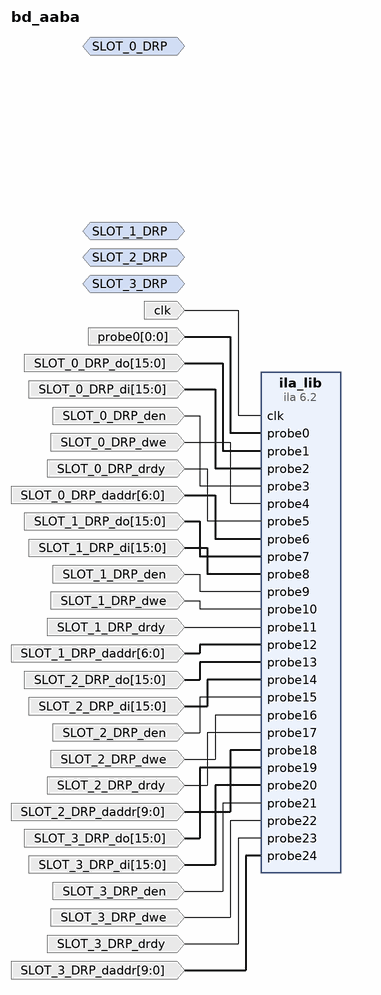
[diagram p0: block diagram of the top level]
# Vivado block design bd_aaba, xcku5p-ffvb676-2-e, Vivado 2018.1
create_bd_design bd_aaba

create_bd_intf_port -mode Monitor -vlnv xilinx.com:interface:drp_rtl:1.0 SLOT_0_DRP
create_bd_intf_port -mode Monitor -vlnv xilinx.com:interface:drp_rtl:1.0 SLOT_1_DRP
create_bd_intf_port -mode Monitor -vlnv xilinx.com:interface:drp_rtl:1.0 SLOT_2_DRP
create_bd_intf_port -mode Monitor -vlnv xilinx.com:interface:drp_rtl:1.0 SLOT_3_DRP
create_bd_port -dir I -type clk clk
create_bd_port -dir I -from 0 -to 0 probe0
create_bd_port -dir I -from 15 -to 0 SLOT_0_DRP_do
create_bd_port -dir I -from 15 -to 0 SLOT_0_DRP_di
create_bd_port -dir I SLOT_0_DRP_den
create_bd_port -dir I SLOT_0_DRP_dwe
create_bd_port -dir I SLOT_0_DRP_drdy
create_bd_port -dir I -from 6 -to 0 SLOT_0_DRP_daddr
create_bd_port -dir I -from 15 -to 0 SLOT_1_DRP_do
create_bd_port -dir I -from 15 -to 0 SLOT_1_DRP_di
create_bd_port -dir I SLOT_1_DRP_den
create_bd_port -dir I SLOT_1_DRP_dwe
create_bd_port -dir I SLOT_1_DRP_drdy
create_bd_port -dir I -from 6 -to 0 SLOT_1_DRP_daddr
create_bd_port -dir I -from 15 -to 0 SLOT_2_DRP_do
create_bd_port -dir I -from 15 -to 0 SLOT_2_DRP_di
create_bd_port -dir I SLOT_2_DRP_den
create_bd_port -dir I SLOT_2_DRP_dwe
create_bd_port -dir I SLOT_2_DRP_drdy
create_bd_port -dir I -from 9 -to 0 SLOT_2_DRP_daddr
create_bd_port -dir I -from 15 -to 0 SLOT_3_DRP_do
create_bd_port -dir I -from 15 -to 0 SLOT_3_DRP_di
create_bd_port -dir I SLOT_3_DRP_den
create_bd_port -dir I SLOT_3_DRP_dwe
create_bd_port -dir I SLOT_3_DRP_drdy
create_bd_port -dir I -from 9 -to 0 SLOT_3_DRP_daddr

create_bd_cell -type ip -vlnv xilinx.com:ip:ila:6.2 ila_lib
set_property -dict [list \
  CONFIG.C_PROBE24_TYPE 0 \
  CONFIG.C_PROBE23_TYPE 0 \
  CONFIG.C_PROBE22_TYPE 0 \
  CONFIG.C_PROBE21_TYPE 0 \
  CONFIG.C_PROBE20_TYPE 0 \
  CONFIG.C_PROBE19_TYPE 0 \
  CONFIG.C_PROBE18_TYPE 0 \
  CONFIG.C_PROBE17_TYPE 0 \
  CONFIG.C_PROBE16_TYPE 0 \
  CONFIG.C_PROBE15_TYPE 0 \
  CONFIG.C_PROBE14_TYPE 0 \
  CONFIG.C_PROBE13_TYPE 0 \
  CONFIG.C_PROBE12_TYPE 0 \
  CONFIG.C_PROBE11_TYPE 0 \
  CONFIG.C_PROBE10_TYPE 0 \
  CONFIG.C_PROBE9_TYPE 0 \
  CONFIG.C_PROBE8_TYPE 0 \
  CONFIG.C_PROBE7_TYPE 0 \
  CONFIG.C_PROBE6_TYPE 0 \
  CONFIG.C_PROBE5_TYPE 0 \
  CONFIG.C_PROBE4_TYPE 0 \
  CONFIG.C_PROBE3_TYPE 0 \
  CONFIG.C_PROBE2_TYPE 0 \
  CONFIG.C_PROBE1_TYPE 0 \
  CONFIG.C_PROBE0_TYPE 0 \
  CONFIG.C_PROBE24_WIDTH 10 \
  CONFIG.C_PROBE23_WIDTH 1 \
  CONFIG.C_PROBE22_WIDTH 1 \
  CONFIG.C_PROBE21_WIDTH 1 \
  CONFIG.C_PROBE20_WIDTH 16 \
  CONFIG.C_PROBE19_WIDTH 16 \
  CONFIG.C_PROBE18_WIDTH 10 \
  CONFIG.C_PROBE17_WIDTH 1 \
  CONFIG.C_PROBE16_WIDTH 1 \
  CONFIG.C_PROBE15_WIDTH 1 \
  CONFIG.C_PROBE14_WIDTH 16 \
  CONFIG.C_PROBE13_WIDTH 16 \
  CONFIG.C_PROBE12_WIDTH 7 \
  CONFIG.C_PROBE11_WIDTH 1 \
  CONFIG.C_PROBE10_WIDTH 1 \
  CONFIG.C_PROBE9_WIDTH 1 \
  CONFIG.C_PROBE8_WIDTH 16 \
  CONFIG.C_PROBE7_WIDTH 16 \
  CONFIG.C_PROBE6_WIDTH 7 \
  CONFIG.C_PROBE5_WIDTH 1 \
  CONFIG.C_PROBE4_WIDTH 1 \
  CONFIG.C_PROBE3_WIDTH 1 \
  CONFIG.C_PROBE2_WIDTH 16 \
  CONFIG.C_PROBE1_WIDTH 16 \
  CONFIG.C_PROBE0_WIDTH 1 \
  CONFIG.C_DATA_DEPTH 1024 \
  CONFIG.C_NUM_OF_PROBES 25 \
  CONFIG.C_XLNX_HW_PROBE_INFO DEFAULT \
  CONFIG.C_TRIGOUT_EN false \
  CONFIG.C_EN_STRG_QUAL 0 \
  CONFIG.C_EN_TIME_TAG 0 \
  CONFIG.C_TIME_TAG_WIDTH 32 \
  CONFIG.C_INPUT_PIPE_STAGES 0 \
  CONFIG.C_ILA_CLK_FREQ 100000000 \
  CONFIG.C_ADV_TRIGGER FALSE \
  CONFIG.C_PROBE0_MU_CNT 1 \
  CONFIG.C_TRIGIN_EN false \
  CONFIG.ALL_PROBE_SAME_MU TRUE \
  CONFIG.ALL_PROBE_SAME_MU_CNT 1 \
  CONFIG.C_MONITOR_TYPE Native \
] [get_bd_cells ila_lib]

# ---- connections ----

connect_bd_net [get_bd_ports clk] [get_bd_pins ila_lib/clk]
connect_bd_net -net probe0_1 [get_bd_ports probe0] [get_bd_pins ila_lib/probe0]
connect_bd_net [get_bd_ports SLOT_0_DRP_do] [get_bd_pins ila_lib/probe1]
connect_bd_net [get_bd_ports SLOT_0_DRP_di] [get_bd_pins ila_lib/probe2]
connect_bd_net [get_bd_ports SLOT_0_DRP_den] [get_bd_pins ila_lib/probe3]
connect_bd_net [get_bd_ports SLOT_0_DRP_dwe] [get_bd_pins ila_lib/probe4]
connect_bd_net [get_bd_ports SLOT_0_DRP_drdy] [get_bd_pins ila_lib/probe5]
connect_bd_net [get_bd_ports SLOT_0_DRP_daddr] [get_bd_pins ila_lib/probe6]
connect_bd_net [get_bd_ports SLOT_1_DRP_do] [get_bd_pins ila_lib/probe7]
connect_bd_net [get_bd_ports SLOT_1_DRP_di] [get_bd_pins ila_lib/probe8]
connect_bd_net [get_bd_ports SLOT_1_DRP_den] [get_bd_pins ila_lib/probe9]
connect_bd_net [get_bd_ports SLOT_1_DRP_dwe] [get_bd_pins ila_lib/probe10]
connect_bd_net [get_bd_ports SLOT_1_DRP_drdy] [get_bd_pins ila_lib/probe11]
connect_bd_net [get_bd_ports SLOT_1_DRP_daddr] [get_bd_pins ila_lib/probe12]
connect_bd_net [get_bd_ports SLOT_2_DRP_do] [get_bd_pins ila_lib/probe13]
connect_bd_net [get_bd_ports SLOT_2_DRP_di] [get_bd_pins ila_lib/probe14]
connect_bd_net [get_bd_ports SLOT_2_DRP_den] [get_bd_pins ila_lib/probe15]
connect_bd_net [get_bd_ports SLOT_2_DRP_dwe] [get_bd_pins ila_lib/probe16]
connect_bd_net [get_bd_ports SLOT_2_DRP_drdy] [get_bd_pins ila_lib/probe17]
connect_bd_net [get_bd_ports SLOT_2_DRP_daddr] [get_bd_pins ila_lib/probe18]
connect_bd_net [get_bd_ports SLOT_3_DRP_do] [get_bd_pins ila_lib/probe19]
connect_bd_net [get_bd_ports SLOT_3_DRP_di] [get_bd_pins ila_lib/probe20]
connect_bd_net [get_bd_ports SLOT_3_DRP_den] [get_bd_pins ila_lib/probe21]
connect_bd_net [get_bd_ports SLOT_3_DRP_dwe] [get_bd_pins ila_lib/probe22]
connect_bd_net [get_bd_ports SLOT_3_DRP_drdy] [get_bd_pins ila_lib/probe23]
connect_bd_net [get_bd_ports SLOT_3_DRP_daddr] [get_bd_pins ila_lib/probe24]

validate_bd_design
save_bd_design
